# EAGLE schematic Node_4Send (EAGLE 7.3.0)
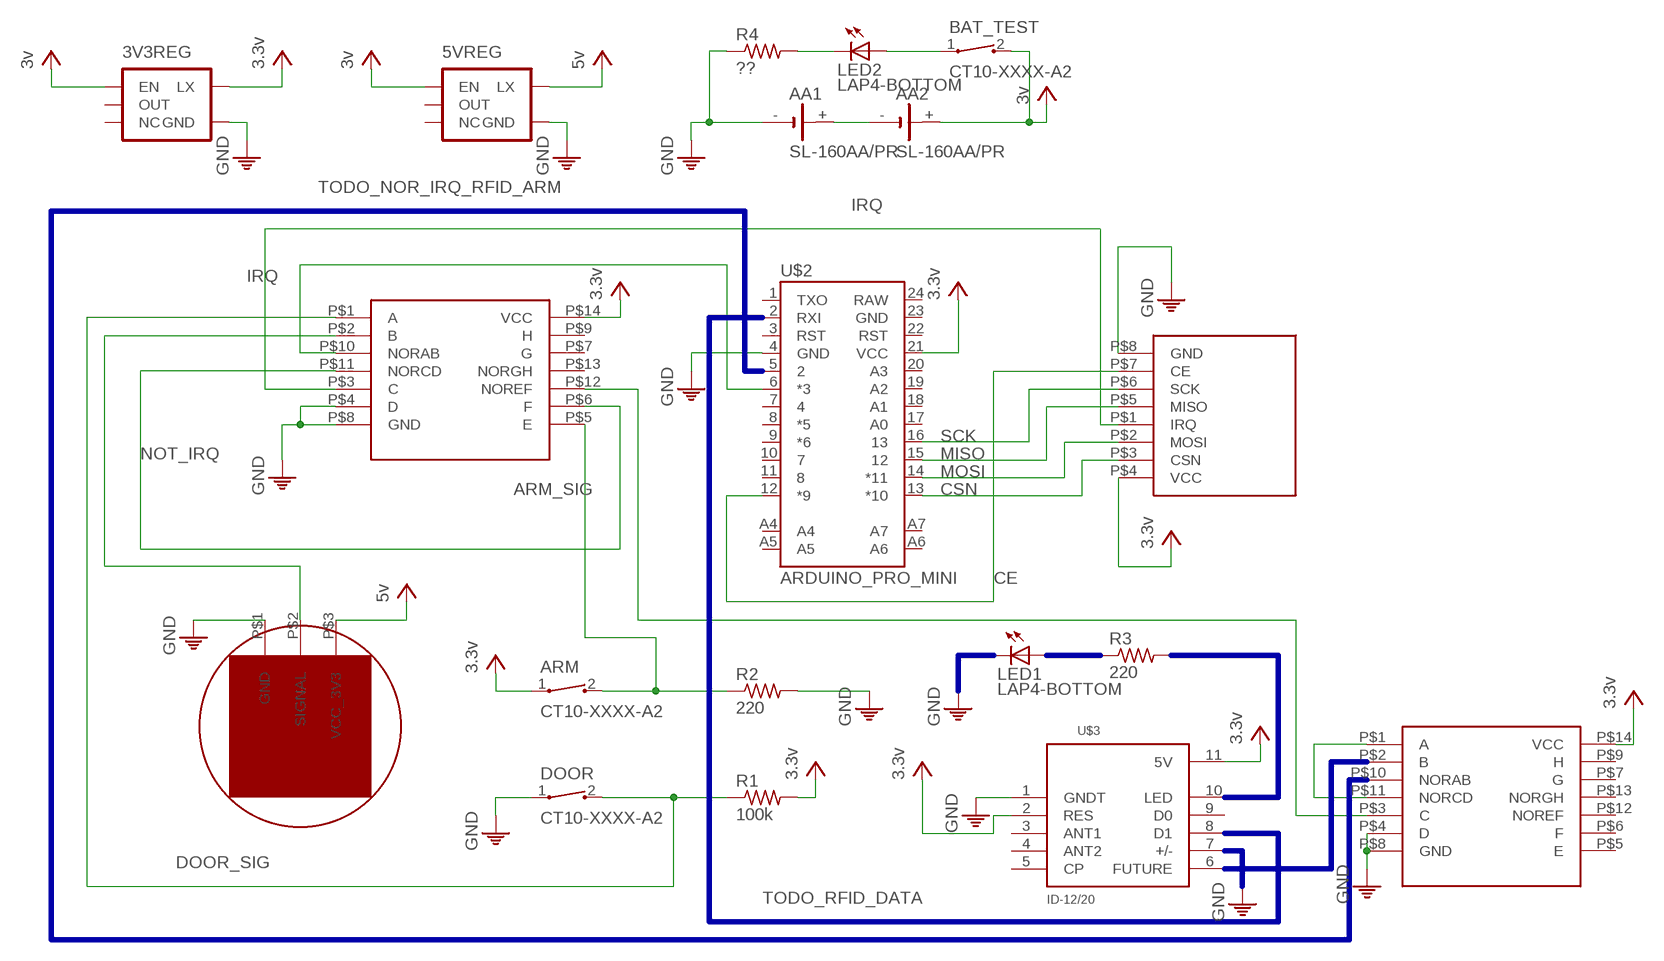
[diagram p0: schematic, sheet 1]

## Parts
3V3REG  V_REG_NCP1400SOT23-5  [SOT23-5]
5VREG  V_REG_NCP1400SOT23-5  [SOT23-5]
AA1  SL-160AA/PR  [SL-160AA/PR]
AA2  SL-160AA/PR  [SL-160AA/PR]
ARM  CT10-XXXX-A2  [CT10-XXXX-A2]
BAT_TEST  CT10-XXXX-A2  [CT10-XXXX-A2]
DOOR  CT10-XXXX-A2  [CT10-XXXX-A2]
LED1  LAP4-BOTTOM  [P47F-BOTTOM]
LED2  LAP4-BOTTOM  [P47F-BOTTOM]
NRF_MODULE  NRF24L01  [NRF24L01]
R1  100k  R-US_0204/5  [0204/5]
R2  220  R-US_0204/5  [0204/5]
R3  220  R-US_0204/5  [0204/5]
R4  ??  R-US_0204/5  [0204/5]
U$1  PIR_MOTION_SENSOR  [3OUT]
U$2  ARDUINO_PRO_MINI  [ARDUINO_PRO_MINI]
U$3  ID-12/20  [ID-12]
U$4  TI_CD4001BE  [14DIP]
U$6  TI_CD4001BE  [14DIP]

## Nets
ARM_SIG: ARM.2 R2.1 U$4.P$5(E)
CE: NRF_MODULE.P$7(CE) U$2.12(*9)
CSN: NRF_MODULE.P$3(CSN) U$2.13(*10)
DOOR_SIG: DOOR.2 R1.1 U$4.P$1(A)
IRQ: NRF_MODULE.P$1(IRQ) U$4.P$3(C)
MISO: NRF_MODULE.P$5(MISO) U$2.15
MOSI: NRF_MODULE.P$2(MOSI) U$2.14(*11)
N$1: AA1.+ AA2.-
N$2: LED2.C R4.2
N$3: U$4.P$12(NOREF) U$6.P$3(C)
N$4: BAT_TEST.1 LED2.A
N$9: U$6.P$1(A) U$6.P$11(NORCD)
N$11: U$1.P$2(SIGNAL) U$4.P$2(B)
N$13: U$2.6(*3) U$4.P$10(NORAB)
NOT_IRQ: U$4.P$6(F) U$4.P$11(NORCD)
PE: 3V3REG.4(GND) 5VREG.4(GND) AA1.- DOOR.1 NRF_MODULE.P$8(GND) R2.2 R4.1 U$1.P$1(GND) U$2.4(GND) U$3.1(GNDT) U$4.P$4(D) U$4.P$8(GND) U$6.P$4(D) U$6.P$8(GND) ; supply symbol labelled GND
SCK: NRF_MODULE.P$6(SCK) U$2.16
VCC: 3V3REG.1(EN) 3V3REG.5(LX) 5VREG.1(EN) 5VREG.5(LX) AA2.+ ARM.1 BAT_TEST.2 NRF_MODULE.P$4(VCC) R1.2 U$1.P$3(VCC_3V3) U$2.21(VCC) U$3.2(RES) U$3.11(5V) U$4.P$14(VCC) U$6.P$14(VCC) ; supply symbol labelled 3v, 3.3v, 5v
Unconnected: 3V3REG.2(OUT) 3V3REG.3(NC) 5VREG.2(OUT) 5VREG.3(NC) LED1.A LED1.C R3.1 R3.2 U$2.1(TXO) U$2.2(RXI) U$2.3(RST) U$2.5 U$2.7 U$2.8(*5) U$2.9(*6) U$2.10 U$2.11 U$2.17(A0) U$2.18(A1) U$2.19(A2) U$2.20(A3) U$2.22(RST) U$2.23(GND) U$2.24(RAW) U$2.A4 U$2.A5 U$2.A6 U$2.A7 U$3.3(ANT1) U$3.4(ANT2) U$3.5(CP) U$3.6(FUTURE) U$3.7(+/-) U$3.8(D1) U$3.9(D0) U$3.10(LED) U$4.P$7(G) U$4.P$9(H) U$4.P$13(NORGH) U$6.P$2(B) U$6.P$5(E) U$6.P$6(F) U$6.P$7(G) U$6.P$9(H) U$6.P$10(NORAB) U$6.P$12(NOREF) U$6.P$13(NORGH)

## Buses
B$6
TODO_NOR_IRQ_RFID_ARM
B$8
TODO_RFID_DATA
B$1
B$2
B$3

## Library data of the parts
3V3REG 5VREG = SparkFun-PowerIC:V_REG_NCP1400: Switching step-up voltage regulator NCP1400 switiching regulator takes single cell AA and outputs 100mA at 3.3V or 5V with minimal number of external components.
AA1 AA2 = battery:SL-160AA/PR: LI BATTERY Sonnenschein
ARM BAT_TEST DOOR = switch-coto:CT10-XXXX-: CT10 Series Molded Switch Source: www.cotorelay.com .. Coto_Technology__CT10-1530-G1.pdf
LED1 LED2 = led:*P4: PointLED® Enhanced Thinfilm LED TOP & BOTTOM mount LS P47F, LR P47F, LA P47F, LY P47F, LT P4SG, LB P4SG, LW P4SG Source: http://catalog.osram-os.com .. LA_LR_LS_LY_P47F_Pb_free.pdf
NRF_MODULE = max parts:NRF24L01
R1-R4 = resistor:R-US_: RESISTOR, American symbol
U$1 = max parts:PIR_MOTION_SENSOR
U$2 = SparkFun-Boards:ARDUINO_PRO_MINI
U$3 = SparkFun-RF:ID-12/20: RFID reader for ID2, ID12, and ID20 Package
U$4 U$6 = max parts:TI_CD4001BE